# Altium schematic sheet MQ.SchDoc
size A4
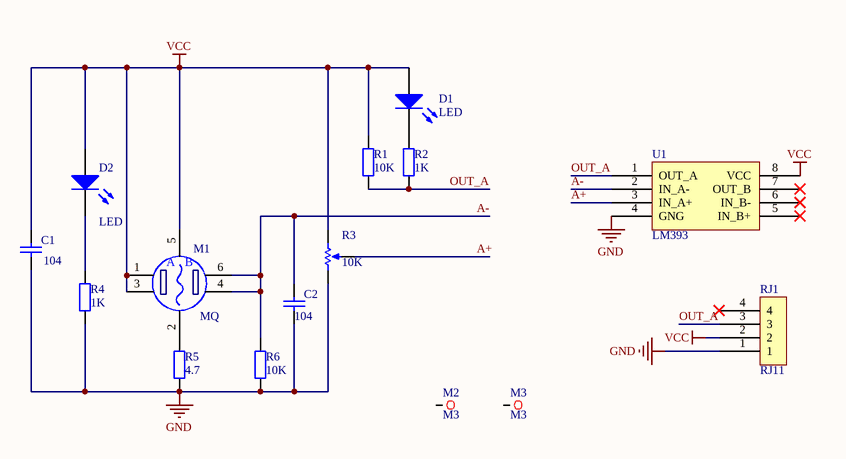
[diagram p0: MQ.SchDoc]

## Parts
C1  value 104  [0603_C]  (hidden comment: Cap)
C2  value 104  [0603_C]  (hidden comment: Cap)
D1  LED  [0805]
D2  LED  [0805]
M1  MQ  [MQ]
M2  M3  [M3]
M3  M3  [M3]
R1  value 10K  [0603_R]  (hidden comment: Res2)
R2  value 1K  [0603_R]  (hidden comment: Res2)
R3  value 10K  [电位器]  (hidden comment: RPot)
R4  value 1K  [0603_R]  (hidden comment: Res2)
R5  value 4.7  [0603_R]  (hidden comment: Res2)
R6  value 10K  [0603_R]  (hidden comment: Res2)
RJ1  RJ11  [RJ11]
U1  LM393  [SO-8]

## Nets
GND: C1.1 C2.1 R3.1(TOP) R4.1 R5.1 R6.1 RJ1.1 U1.4(GNG)
VCC: C1.2 D1.1(A) D2.1(A) M1.1 M1.3 M1.5 R1.2 R3.2(BOT) RJ1.2 U1.8(VCC)
A+: R3.3(TAP) U1.3(IN_A+)
A-: C2.2 M1.4 M1.6 R6.2 U1.2(IN_A-)
OUT_A: R1.1 R2.1 RJ1.3 U1.1(OUT_A)
NetD1_2: D1.2(K) R2.2
NetD2_2: D2.2(K) R4.2
NetM1_2: M1.2 R5.2

Not connected (* = marked no-connect by the designer): M2 0; M3 0; RJ1 4*; U1 5(IN_B+)* 6(IN_B-)* 7(OUT_B)*

## Notes on the sheet
- (in symbol MQ) A; B

## Library data of the parts
C1 C2 = Cap: Capacitor; Published: 8-Jun-2000; LatestRevisionDate: 17-Jul-2002; LatestRevisionNote: Re-released for DXP Platform.; PackageReference: RAD-0.3; Publisher: Altium Limited
D1 D2 = LED1: Typical RED GaAs LED; Published: 8-Jun-2000; LatestRevisionDate: 08-Jul-2005; LatestRevisionNote: Mech Layer 1 removed.; PackageReference: LED-1; Publisher: Altium Limited
R1 R2 R4-R6 = Res2: Resistor; Published: 8-Jun-2000; LatestRevisionDate: 17-Jul-2002; LatestRevisionNote: Re-released for DXP Platform.; PackageReference: AXIAL-0.4; Publisher: Altium Limited
R3 = RPot: Potentiometer; Sim Note: Enter the Resistance value and the set point into parameter fields.; Set Position: 0.5; Published: 8-Jun-2000; LatestRevisionDate: 17-Jul-2002; LatestRevisionNote: Re-released for DXP Platform.; PackageReference: VR5; Publisher: Altium Limited